# EAGLE design Segger_JTAG_v1p3 (EAGLE 9.5.1)
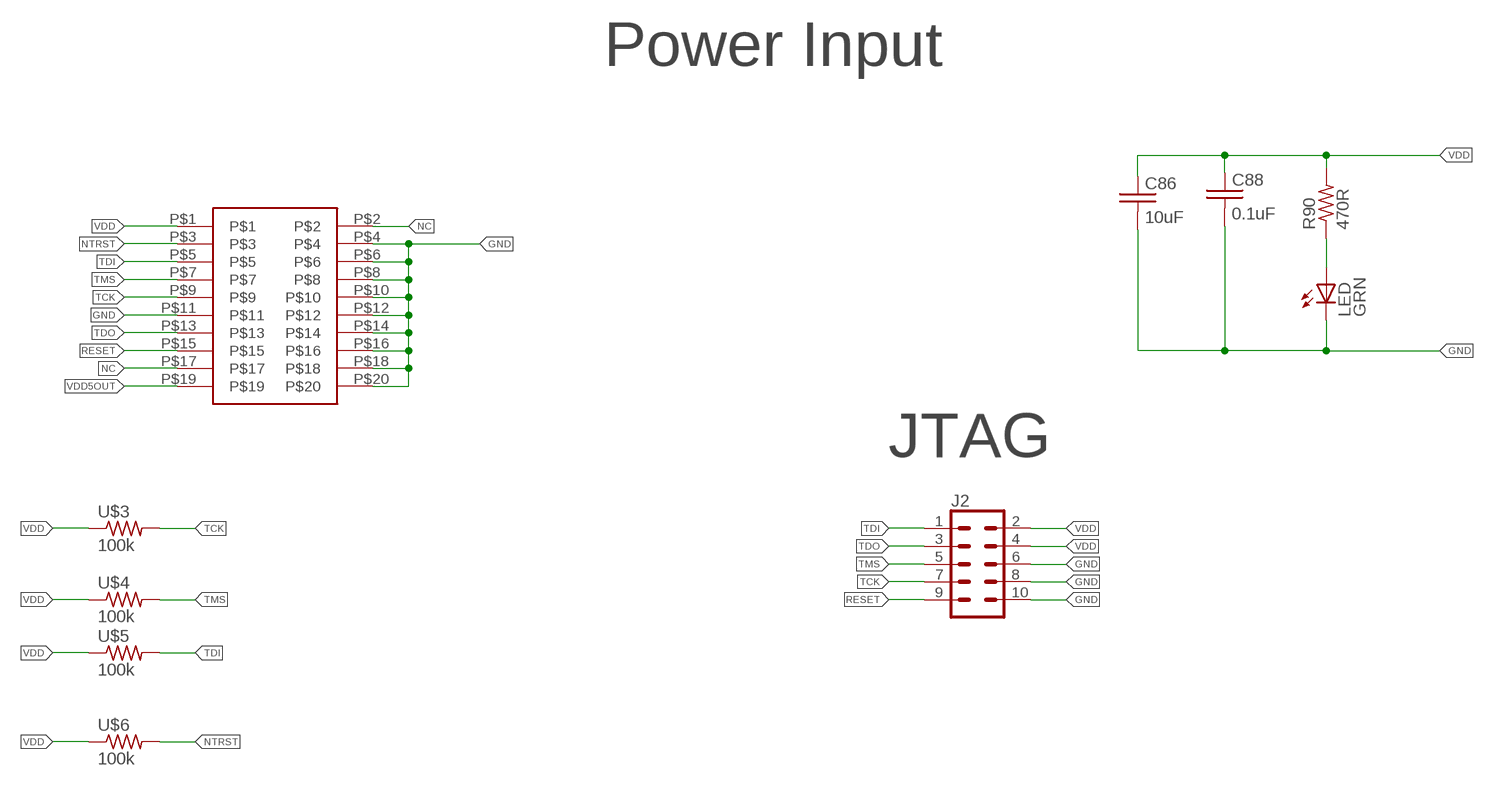
[diagram p0: schematic, sheet 1]

## Parts
C86  10uF  C_0805  [0805]
C88  0.1uF  C_0805  [0805]
J2  CONN_05X2PTH  [2X5]
LED  LED_0805_GREEN  [LED_0805_GREEN]
R90  470R  R_0805  [0805]
U$2  2_X_10_HEADER_GENERIC  [2_X_10_.1_INCH]
U$3  100k  R_0805  [0805]
U$4  100k  R_0805  [0805]
U$5  100k  R_0805  [0805]
U$6  100k  R_0805  [0805]

## Nets
GND: C86.2 C88.2 J2.6 J2.8 J2.10 LED.C U$2.P$4 U$2.P$6 U$2.P$8 U$2.P$10 U$2.P$11 U$2.P$12 U$2.P$14 U$2.P$16 U$2.P$18 U$2.P$20
N$7: LED.A R90.1
NC: U$2.P$2 U$2.P$17
NTRST: U$2.P$3 U$6.2
RESET: J2.9 U$2.P$15
TCK: J2.7 U$2.P$9 U$3.2
TDI: J2.1 U$2.P$5 U$5.2
TDO: J2.3 U$2.P$13
TMS: J2.5 U$2.P$7 U$4.2
VDD: C86.1 C88.1 J2.2 J2.4 R90.2 U$2.P$1 U$3.1 U$4.1 U$5.1 U$6.1
VDD5OUT: U$2.P$19

## Notes on the sheet
- Power Input
- JTAG

## Library data of the parts
C86 C88 = 3D_MIG_Controller:C_0805
J2 = 3D_MIG_Controller:CONN_05X2: Multi connection point. Often used as Generic Header-pin footprint for 0.1 inch spaced/style header connections For AVR SPI programming port, see special device with nice symbol: "AVR_SPI_PROG_5x2.dev" You can populate with any combo of single row headers, but if you'd like an exact match, check these: 2x5 AVR ICSP Male Header <https://www.sparkfun.com/products/778> (PRT-00778) 2x5 Pin Shrouded Header <https://www.sparkfun.com/products/8506> (PRT-08506) On any of the 0.1 inch spaced packages, you can populate with these: Break Away Headers - Straight <https://www.sparkfun.com/products/116> (PRT-00116) Break Away Male Headers - Right Angle <https://www.sparkfun.com/products/553> (PRT-00553) Female Headers <https://www.sparkfun.com/products/115> (PRT-00115) Break Away Headers - Machine Pin <https://www.sparkfun.com/products/117> (PRT-00117) Break Away Female Headers - Swiss Machine Pin <https://www.sparkfun.com/products/743> (PRT-00743) Special note: the shrouded connector mates well with our 5x2 ribbon cables: 2x5 Pin IDC Ribbon Cable <https://www.sparkfun.com/products/8535> (PRT-08535); PROD_ID: CONN-08499; SF_ID: PRT-0778
LED = 3D_MIG_Controller:LED_0805_GREEN
R90 U$3-U$6 = 3D_MIG_Controller:R_0805
U$2 = 3D_MIG_Controller:2_X_10_HEADER_GENERIC

## Board
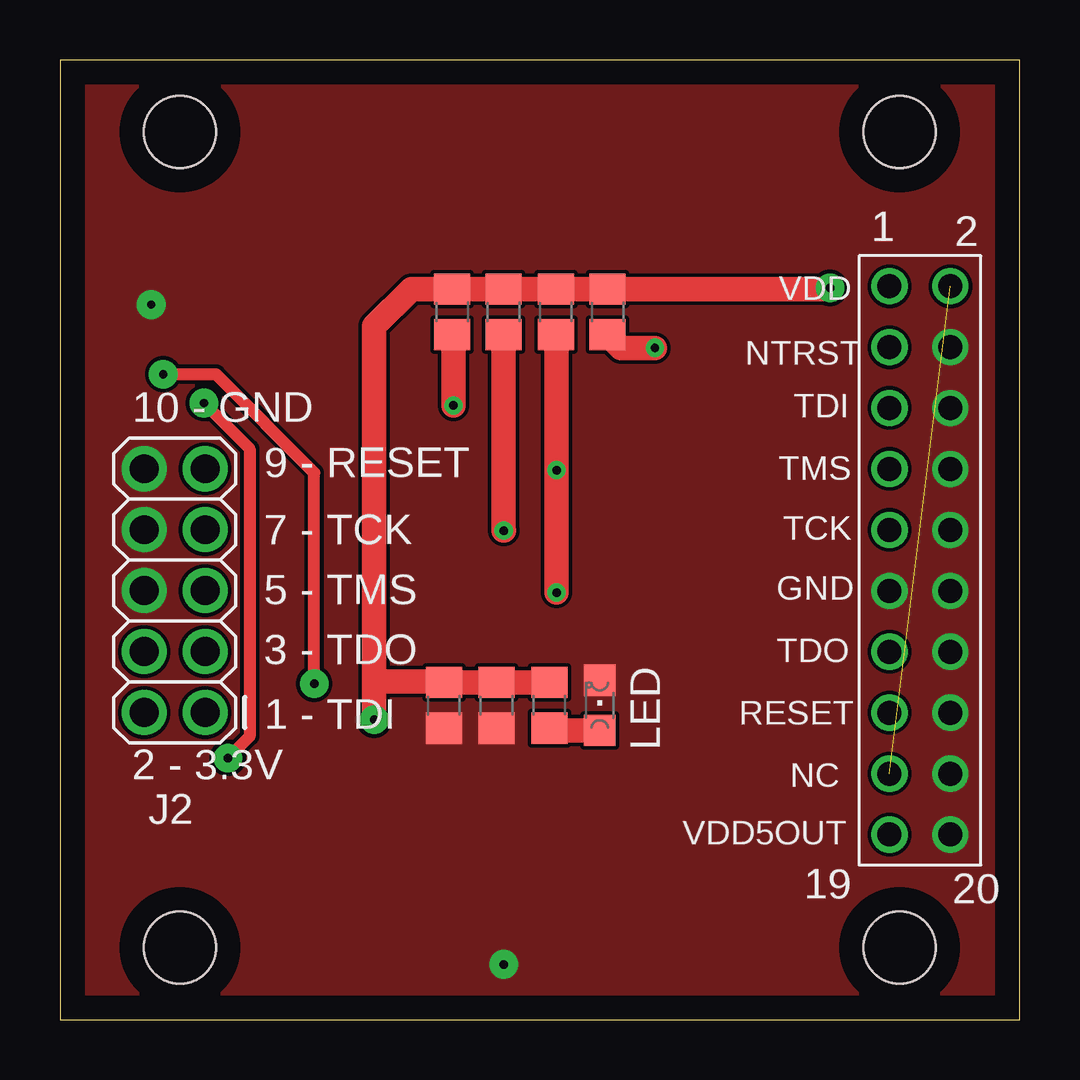
[diagram p1: board, top side]
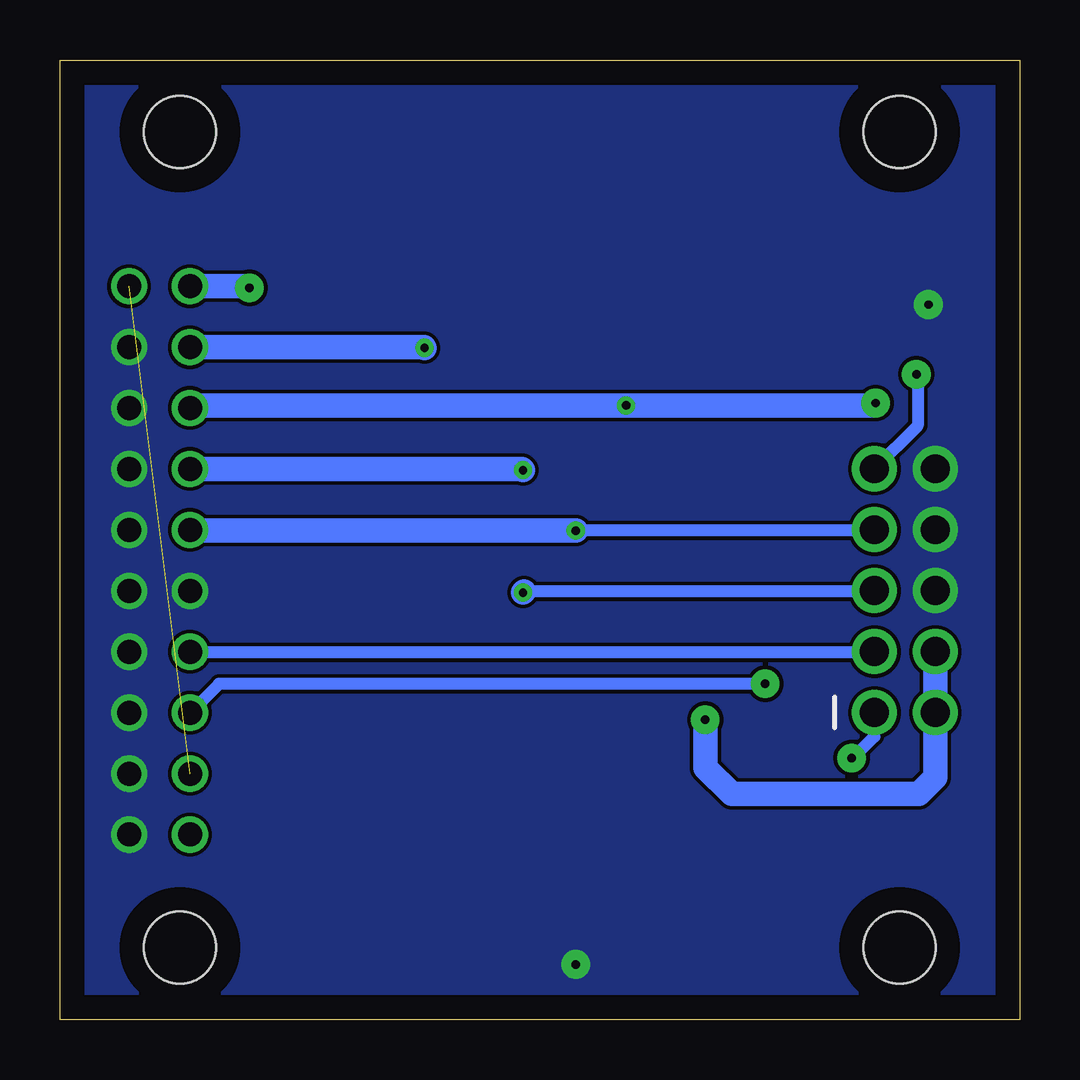
[diagram p2: board, bottom side, seen from below]

Size 40 x 40 mm. Coordinates in mm from the lower left corner, seen from the top.
Outline: 0,0 40,0 40,40 0,40 0,0
Copper layers (1*16): Top 0.035mm / dielectric 1.5mm / Bottom 0.035mm
Design rules "default": minimum track width 6mil, minimum drill 0.35mm, track to track 6mil, track to pad 6mil, pad to pad 6mil, via to via 6mil, smd to smd 6mil, copper to edge 40mil, drill to drill 6mil, minimum pad ring 10mil, minimum via ring 8mil, stop-mask expansion 4mil, vias tented up to drill 0mil, thermal gap 10mil
Holes 3 mm at 5,37 35,37 35,3 5,3

### Footprints (pad centres in the part's own frame; a part is rotated, then mirrored left to right if it is on the bottom)
0805 = smd 1.3 x 1.5: 1 -0.95,0; 2 0.95,0
2X5 = drill 1.2 pad 1.88: 1 0,0; 2 0,2.54; 3 2.54,0; 4 2.54,2.54; 5 5.08,0; 6 5.08,2.54; 7 7.62,0; 8 7.62,2.54; 9 10.16,0; 10 10.16,2.54
LED_0805_GREEN = smd 1.3 x 1.3: A 0,-1.05; C 0,1.05
2_X_10_.1_INCH = drill 1: P$1 -11.43,-1.27; P$2 -11.43,1.27; P$3 -8.89,-1.27; P$4 -8.89,1.27; P$5 -6.35,-1.27; P$6 -6.35,1.27; P$7 -3.81,-1.27; P$8 -3.81,1.27; P$9 -1.27,-1.27; P$10 -1.27,1.27; P$11 1.27,-1.27; P$12 1.27,1.27; P$13 3.81,-1.27; P$14 3.81,1.27; P$15 6.35,-1.27; P$16 6.35,1.27; P$17 8.89,-1.27; P$18 8.89,1.27; P$19 11.43,-1.27; P$20 11.43,1.27

### Placement (x,y rotation side)
C86  18.2,13.1 270 top
C88  16,13.1 270 top
J2  6.05,12.8 90 top
LED  22.5,13.1 0 top
R90  20.4,13.1 90 top
U$2  35.85,19.14 270 top
U$3  18.49,29.5 270 top
U$4  20.67,29.5 270 top
U$5  16.35,29.5 270 top
U$6  22.83,29.5 270 top

### Tracks (layer width: path | path; a pad name or v marks a point on that pad's centre or on a via)
GND  (via drill 0.35 pad 1.2)
  Bottom 0.2: v3.79,29.8 v3.8,29.8
  other vias: 18.5,2.3
  pour Bottom (no thermals): 0,40 40,40 40,0 0,0
  pour Top (no thermals): 0,40 40,40 40,0 0,0
N$7
  Top 1.016: R90.1 20.5,12.05 LED.A
NC  (1 unrouted)
NTRST  (via drill 0.35)
  Top 1.016: v24.8,28 23.38,28 U$6.2
  Bottom 1.016: U$2.P$3 24.83,28.03 v24.8,28
RESET  (via drill 0.35 pad 1.2)
  Top 0.508: v10.6,14 10.6,22.8 6.5,26.9 v4.3,26.9
  Bottom 0.508: 4.18,27.02 v4.3,26.9 4.25,26.85 4.25,24.76 J2.9 | v10.6,14 33.37,14 U$2.P$15
TCK  (via drill 0.35)
  Top 1.016: U$3.2 v18.49,20.39 v18.5,20.38
  Bottom 0.508: J2.7 6.09,20.38 v18.5,20.38
  Bottom 1.016: v18.5,20.38 34.55,20.38 U$2.P$9
TDI  (via drill 0.35, 0.35 pad 1.2)
  Top 0.508: v6,25.7 7.9,23.8 7.9,11.8 v7,10.9
  Top 1.016: U$5.2 16.4,28.5 v16.4,25.6
  Bottom 0.508: 6.05,25.65 v6,25.7 | v7,10.9 6.95,10.9 6.05,11.8 J2.1
  Bottom 1.016: v6,25.7 6.1,25.6 v16.4,25.6 34.47,25.6 U$2.P$5
TDO
  Bottom 0.508: U$2.P$13 34.55,15.3 6.09,15.3 J2.3
TMS  (via drill 0.35)
  Top 1.016: v20.7,17.8 v20.7,22.9 20.7,28.52 U$4.2
  Bottom 0.508: J2.5 6.09,17.84 20.66,17.84
  Bottom 1.016: 20.66,17.84 v20.7,17.8 | U$2.P$7 20.75,22.95 v20.7,22.9
VDD  (via drill 0.35 pad 1.2)
  Top 1.016: v32.1,30.5 32.05,30.45 U$6.1 U$4.1 U$3.1 U$5.1 14.65,30.45 13.1,28.9 13.1,14.1 | v13.1,12.5 13.1,14.1 | 13.1,14.1 15.95,14.1 C88.1 C86.1 R90.2
  Bottom 1.016: v13.1,12.5 13.1,10.5 12,9.4 4.2,9.4 3.51,10.09 J2.2 J2.4 | U$2.P$1 32.17,30.57 v32.1,30.5

### Text on the board
tPlace: 1 | 2 | VDD | NTRST | TDI | 10 - GND | TMS | 9 - RESET | TCK | 7 - TCK | GND | 5 - TMS | TDO | 3 - TDO | RESET | 1 - TDI | NC | 2 - 3.3V | VDD5OUT | 19 | 20